# EAGLE design andre industrial microcontroler (EAGLE 9.6.2)
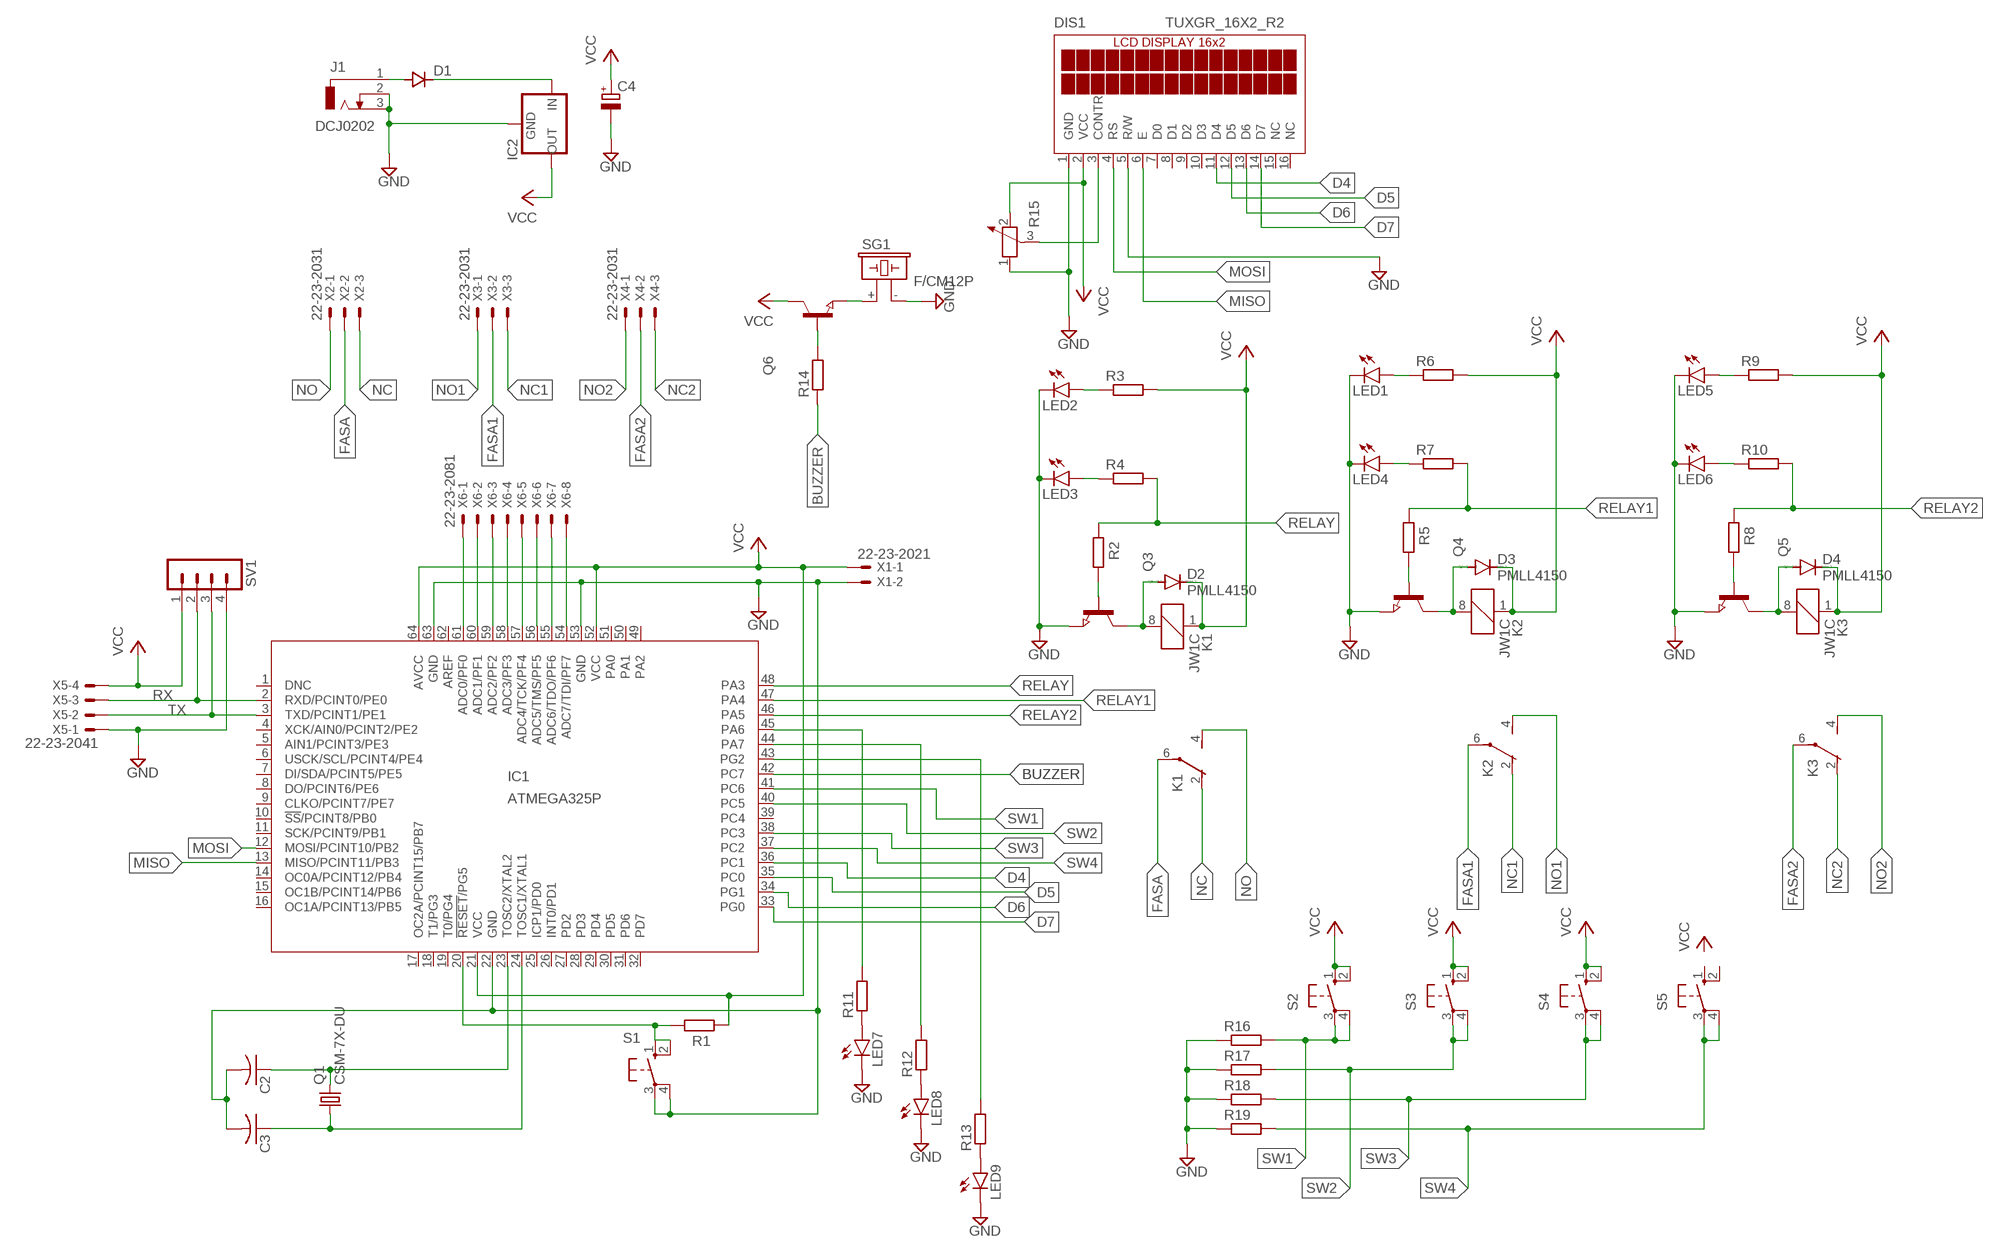
[diagram p0: schematic, sheet 1]

## Parts
C2  C-US025-024X044  [C025-024X044]
C3  C-US025-024X044  [C025-024X044]
C4  CPOL-EU140CLH-0810  [140CLH-0810]
D1  DSOD323  [SOD323]
D2  PMLL4150  [SOD80C]
D3  PMLL4150  [SOD80C]
D4  PMLL4150  [SOD80C]
DIS1  TUXGR_16X2_R2  [TUXGR_16X2_R2]
IC1  ATMEGA325P  [64M1]
IC2  78XXS  [78XXS]
J1  DCJ0202  [DCJ0202]
K1  JW1C  [JW1C]
K2  JW1C  [JW1C]
K3  JW1C  [JW1C]
LED1  LEDCHIP-LED0805  [CHIP-LED0805]
LED2  LEDCHIP-LED0805  [CHIP-LED0805]
LED3  LEDCHIP-LED0805  [CHIP-LED0805]
LED4  LEDCHIP-LED0805  [CHIP-LED0805]
LED5  LEDCHIP-LED0805  [CHIP-LED0805]
LED6  LEDCHIP-LED0805  [CHIP-LED0805]
LED7  LEDCHIP-LED0805  [CHIP-LED0805]
LED8  LEDCHIP-LED0805  [CHIP-LED0805]
LED9  LEDCHIP-LED0805  [CHIP-LED0805]
Q1  CSM-7X-DU  [CSM-7X-DU]
Q3  NPN-TRANSISTOR_SOT23  [SOT23]
Q4  NPN-TRANSISTOR_SOT23  [SOT23]
Q5  NPN-TRANSISTOR_SOT23  [SOT23]
Q6  NPN-TRANSISTOR_SOT23  [SOT23]
R1  R-EU_R0805  [R0805]
R2  R-EU_R0805  [R0805]
R3  R-EU_R0805  [R0805]
R4  R-EU_R0805  [R0805]
R5  R-EU_R0805  [R0805]
R6  R-EU_R0805  [R0805]
R7  R-EU_R0805  [R0805]
R8  R-EU_R0805  [R0805]
R9  R-EU_R0805  [R0805]
R10  R-EU_R0805  [R0805]
R11  R-EU_R0805  [R0805]
R12  R-EU_R0805  [R0805]
R13  R-EU_R0805  [R0805]
R14  R-EU_R0805  [R0805]
R15  POTENTIOMETER_PT-10  [PT-10]
R16  R-EU_R0805  [R0805]
R17  R-EU_R0805  [R0805]
R18  R-EU_R0805  [R0805]
R19  R-EU_R0805  [R0805]
S1  10-XX  [B3F-10XX]
S2  10-XX  [B3F-10XX]
S3  10-XX  [B3F-10XX]
S4  10-XX  [B3F-10XX]
S5  10-XX  [B3F-10XX]
SG1  F/CM12P  [F/CM12P]
SV1  MA04-1  [MA04-1]
X1  22-23-2021  [22-23-2021]
X2  22-23-2031  [22-23-2031]
X3  22-23-2031  [22-23-2031]
X4  22-23-2031  [22-23-2031]
X5  22-23-2041  [22-23-2041]
X6  22-23-2081  [22-23-2081]

## Nets
BUZZER: IC1.42(PC7) R14.1
D4: DIS1.11(D4) IC1.36(PC1)
D5: DIS1.12(D5) IC1.35(PC0)
D6: DIS1.13(D6) IC1.34(PG1)
D7: DIS1.14(D7) IC1.33(PG0)
FASA: K1.6(1:P) X2.2
FASA1: K2.6(1:P) X3.2
FASA2: K3.6(1:P) X4.2
GND: C2.2 C3.2 C4.- DIS1.1(GND) DIS1.5(R/W) IC1.22(GND) IC1.53(GND) IC1.63(GND) IC2.GND J1.2 J1.3 LED1.C LED2.C LED3.C LED4.C LED5.C LED6.C LED7.C LED8.C LED9.C Q3.2(E) Q4.2(E) Q5.2(E) R15.1 R16.1 R17.1 R18.1 R19.1 S1.3(P) S1.4(P1) SG1.- SV1.4 X1.2 X5.1
MISO: DIS1.6(E) IC1.13(MISO/PCINT11/PB3)
MOSI: DIS1.4(RS) IC1.12(MOSI/PCINT10/PB2)
N$1: IC1.20(!RESET!/PG5) R1.1 S1.1(S) S1.2(S1)
N$2: D1.1(C) IC2.IN
N$3: D1.2(A) J1.1
N$4: C2.1 IC1.23(TOSC2/XTAL2) Q1.2
N$5: C3.1 IC1.24(TOSC1/XTAL1) Q1.1
N$6: D3.A K2.8 Q4.3(C)
N$7: D2.A K1.8 Q3.3(C)
N$8: Q4.1(B) R5.1
N$9: Q3.1(B) R2.1
N$10: LED3.A R4.1
N$11: LED2.A R3.1
N$12: LED4.A R7.1
N$13: LED1.A R6.1
N$14: D4.A K3.8 Q5.3(C)
N$15: Q5.1(B) R8.1
N$16: LED6.A R10.1
N$17: LED5.A R9.1
N$20: LED9.A R13.1
N$21: IC1.43(PG2) R13.2
N$22: IC1.45(PA6) R11.2
N$23: LED7.A R11.1
N$24: IC1.44(PA7) R12.2
N$25: LED8.A R12.1
N$26: IC1.61(ADC0/PF0) X6.1
N$27: IC1.60(ADC1/PF1) X6.2
N$28: IC1.59(ADC2/PF2) X6.3
N$29: IC1.58(ADC3/PF3) X6.4
N$30: IC1.57(ADC4/TCK/PF4) X6.5
N$31: IC1.56(ADC5/TMS/PF5) X6.6
N$32: IC1.55(ADC6/TDO/PF6) X6.7
N$33: IC1.54(ADC7/TDI/PF7) X6.8
N$34: Q6.2(E) SG1.+
N$35: Q6.1(B) R14.2
N$36: DIS1.3(CONTR) R15.3
NC: K1.2(1:O) X2.3
NC1: K2.2(1:O) X3.3
NC2: K3.2(1:O) X4.3
NO: K1.4(1:S) X2.1
NO1: K2.4(1:S) X3.1
NO2: K3.4(1:S) X4.1
RELAY: IC1.48(PA3) R2.2 R4.2
RELAY1: IC1.47(PA4) R5.2 R7.2
RELAY2: IC1.46(PA5) R8.2 R10.2
RX: IC1.2(RXD/PCINT0/PE0) SV1.2 X5.3
SW1: IC1.41(PC6) R16.2 S2.3(P) S2.4(P1)
SW2: IC1.40(PC5) R17.2 S3.3(P) S3.4(P1)
SW3: IC1.38(PC3) R18.2 S4.3(P) S4.4(P1)
SW4: IC1.37(PC2) R19.2 S5.3(P) S5.4(P1)
TX: IC1.3(TXD/PCINT1/PE1) SV1.3 X5.2
VCC: C4.+ D2.C D3.C D4.C DIS1.2(VCC) IC1.21(VCC) IC1.52(VCC) IC1.64(AVCC) IC2.OUT K1.1 K2.1 K3.1 Q6.3(C) R1.2 R3.2 R6.2 R9.2 R15.2 S2.1(S) S2.2(S1) S3.1(S) S3.2(S1) S4.1(S) S4.2(S1) SV1.1 X1.1 X5.4
Unconnected: DIS1.7(D0) DIS1.8(D1) DIS1.9(D2) DIS1.10(D3) DIS1.15(NC) DIS1.16(NC) IC1.1(DNC) IC1.4(XCK/AIN0/PCINT2/PE2) IC1.5(AIN1/PCINT3/PE3) IC1.6(USCK/SCL/PCINT4/PE4) IC1.7(DI/SDA/PCINT5/PE5) IC1.8(DO/PCINT6/PE6) IC1.9(CLKO/PCINT7/PE7) IC1.10(!SS!/PCINT8/PB0) IC1.11(SCK/PCINT9/PB1) IC1.14(OC0A/PCINT12/PB4) IC1.15(OC1B/PCINT14/PB6) IC1.16(OC1A/PCINT13/PB5) IC1.17(OC2A/PCINT15/PB7) IC1.18(T1/PG3) IC1.19(T0/PG4) IC1.25(ICP1/PD0) IC1.26(INT0/PD1) IC1.27(PD2) IC1.28(PD3) IC1.29(PD4) IC1.30(PD5) IC1.31(PD6) IC1.32(PD7) IC1.39(PC4) IC1.49(PA2) IC1.50(PA1) IC1.51(PA0) IC1.62(AREF) S5.1(S) S5.2(S1)

## Library data of the parts
C2 C3 = rcl:C-US: CAPACITOR, American symbol; SPICEPREFIX: C
C4 = rcl:CPOL-EU: POLARIZED CAPACITOR, European symbol; SPICEPREFIX: C
D1 = zetex:D: DIODE; MPN: CDSOD323-T05C; OC_FARNELL: 1824860; OC_NEWARK: 79R6078
D2-D4 = diode:PMLL4150: DIODE high speed
DIS1 = display-lcd:TUXGR_16X2_R2: Tuxgraphics LCD display 16x2 characters reflective, without background light Source: tuxgr_12x2_r2.pdf; OC_FARNELL: unknown; OC_NEWARK: unknown
IC1 = atmel:ATMEGA325P: 8-bit Microcontroller with 32K Bytes In-System Programmable Flash Source: http://www.atmel.com .. doc8023.pdf; MPN: ATMEGA325PV-10AU; OC_FARNELL: 1636939; OC_NEWARK: 03P2025
IC2 = v-reg:78XXS: VOLTAGE REGULATOR
J1 = con-jack:DCJ0202: DC POWER JACK Source: DCJ0202.pdf; OC_FARNELL: unknown; OC_NEWARK: unknown
K1-K3 = relay:JW1C: Power relay Source: Panasonic Electric Works Co., Ltd. / jw.catalog.pdf
LED1-LED9 = led:LED: LED OSRAM: - CHIPLED LG R971, LG N971, LY N971, LG Q971, LY Q971, LO R971, LY R971 LH N974, LH R974 LS Q976, LO Q976, LY Q976 LO Q996 - Hyper CHIPLED LW Q18S LB Q993, LB Q99A, LB R99A - SideLED LS A670, LO A670, LY A670, LG A670, LP A670 LB A673, LV A673, LT A673, LW A673 LH A674 LY A675 LS A676, LA A676, LO A676, LY A676, LW A676 LS A679, LY A679, LG A679 - Hyper Micro SIDELED® LS Y876, LA Y876, LO Y876, LY Y876 LT Y87S - SmartLED LW L88C, LW L88S LB L89C, LB L89S, LG L890 LS L89K, LO L89K, LY L89K LS L896, LA L896, LO L896, LY L896 - TOPLED LS T670, LO T670, LY T670, LG T670, LP T670 LSG T670, LSP T670, LSY T670, LOP T670, LYG T670 LG T671, LOG T671, LSG T671 LB T673, LV T673, LT T673, LW T673 LH T674 LS T676, LA T676, LO T676, LY T676, LB T676, LH T676, LSB T676, LW T676 LB T67C, LV T67C, LT T67C, LS T67K, LO T67K, LY T67K, LW E67C LS E67B, LA E67B, LO E67B, LY E67B, LB E67C, LV E67C, LT E67C LW T67C LS T679, LY T679, LG T679 LS T770, LO T770, LY T770, LG T770, LP T770 LB T773, LV T773, LT T773, LW T773 LH T774 LS E675, LA E675, LY E675, LS T675 LS T776, LA T776, LO T776, LY T776, LB T776 LHGB T686 LT T68C, LB T68C - Hyper Mini TOPLED® LB M676 - Mini TOPLED Santana® LG M470 LS M47K, LO M47K, LY M47K Source: http://www.osram.convergy.de LUXEON: - LUMILED® LXK2-PW12-R00, LXK2-PW12-S00, LXK2-PW14-U00, LXK2-PW14-V00 LXK2-PM12-R00, LXK2-PM12-S00, LXK2-PM14-U00 LXK2-PE12-Q00, LXK2-PE12-R00, LXK2-PE12-S00, LXK2-PE14-T00, LXK2-PE14-U00 LXK2-PB12-K00, LXK2-PB12-L00, LXK2-PB12-M00, LXK2-PB14-N00, LXK2-PB14-P00, LXK2-PB14-Q00 LXK2-PR12-L00, LXK2-PR12-M00, LXK2-PR14-Q00, LXK2-PR14-R00 LXK2-PD12-Q00, LXK2-PD12-R00, LXK2-PD12-S00 LXK2-PH12-R00, LXK2-PH12-S00 LXK2-PL12-P00, LXK2-PL12-Q00, LXK2-PL12-R00 Source: www.luxeon.com KINGBRIGHT: KA-3528ASYC Source: www.kingbright.com
Q1 = crystal:CSM-7X-DU: SMD CRYSTAL Source: www.ecsxtal.com .. Crystal 3.6864MHz CSM_7X_DU.PDF; OC_FARNELL: unknown; OC_NEWARK: unknown
Q3-Q6 = semicon-smd-ipc:NPN-TRANSISTOR_: NPN TRANSISTOR
R1-R14 R16-R19 = rcl:R-EU_: RESISTOR, European symbol; SPICEPREFIX: R
R15 = rcl:POTENTIOMETER_: Potentiometer; SPICEMODEL: POT; SPICEPREFIX: X
S1-S5 = switch-omron:10-XX: OMRON SWITCH; MPN: B3F-1000; OC_FARNELL: 176432; OC_NEWARK: 36M3542
SG1 = buzzer:F/CM12P: BUZZER Source: Buerklin; OC_FARNELL: unknown; OC_NEWARK: unknown
SV1 = con-lstb:MA04-1: PIN HEADER; OC_FARNELL: unknown; OC_NEWARK: unknown
X1 = con-molex:22-23-2021: .100" (2.54mm) Center Header - 2 Pin; MF: MOLEX; MPN: 22-23-2021; OC_FARNELL: 1462926; OC_NEWARK: 25C3832
X2-X4 = con-molex:22-23-2031: .100" (2.54mm) Center Header - 3 Pin; MF: MOLEX; MPN: 22-23-2031; OC_FARNELL: 1462950; OC_NEWARK: 30C0862
X5 = con-molex:22-23-2041: .100" (2.54mm) Center Header - 4 Pin; MF: MOLEX; MPN: 22-23-2041; OC_FARNELL: 1462920; OC_NEWARK: 38C0355
X6 = con-molex:22-23-2081: .100" (2.54mm) Center Header - 8 Pin; MF: MOLEX; MPN: 22-23-2081; OC_FARNELL: 1756826; OC_NEWARK: 01C7592

## Board
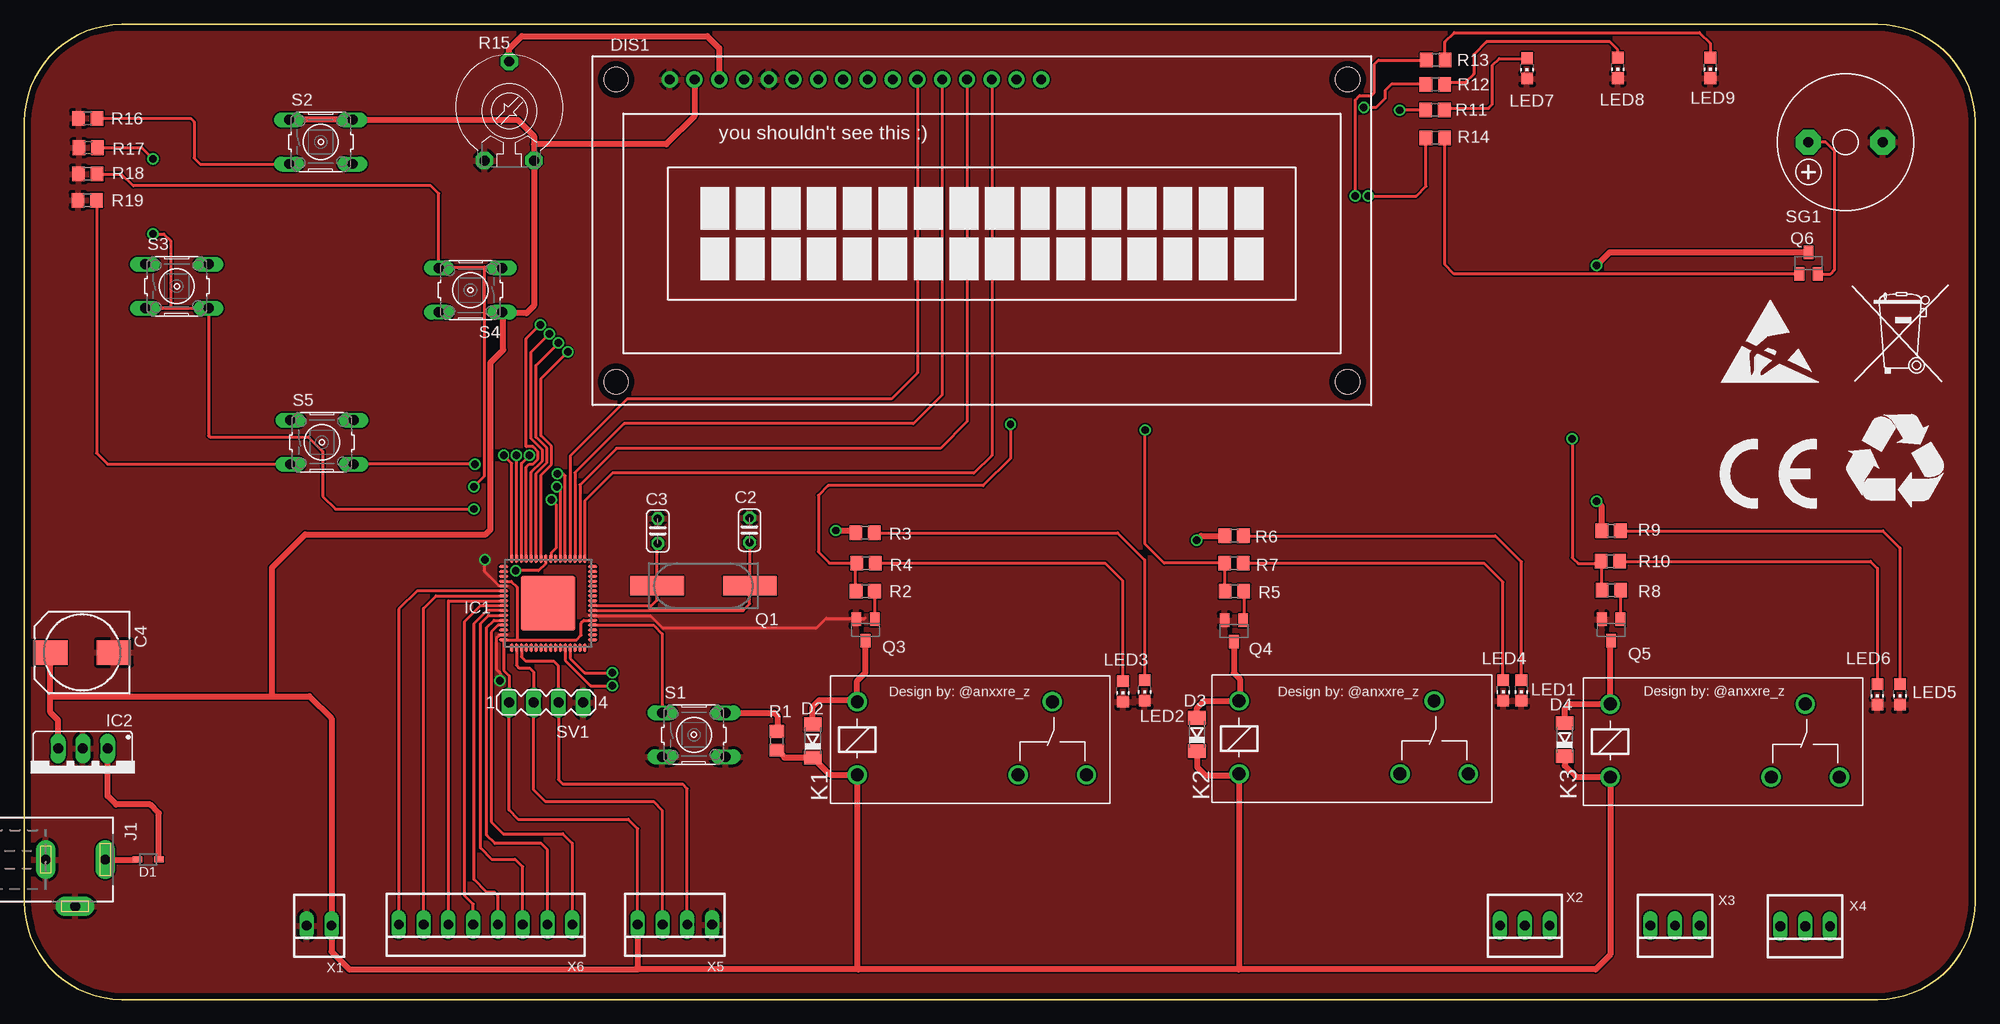
[diagram p1: board, top side]
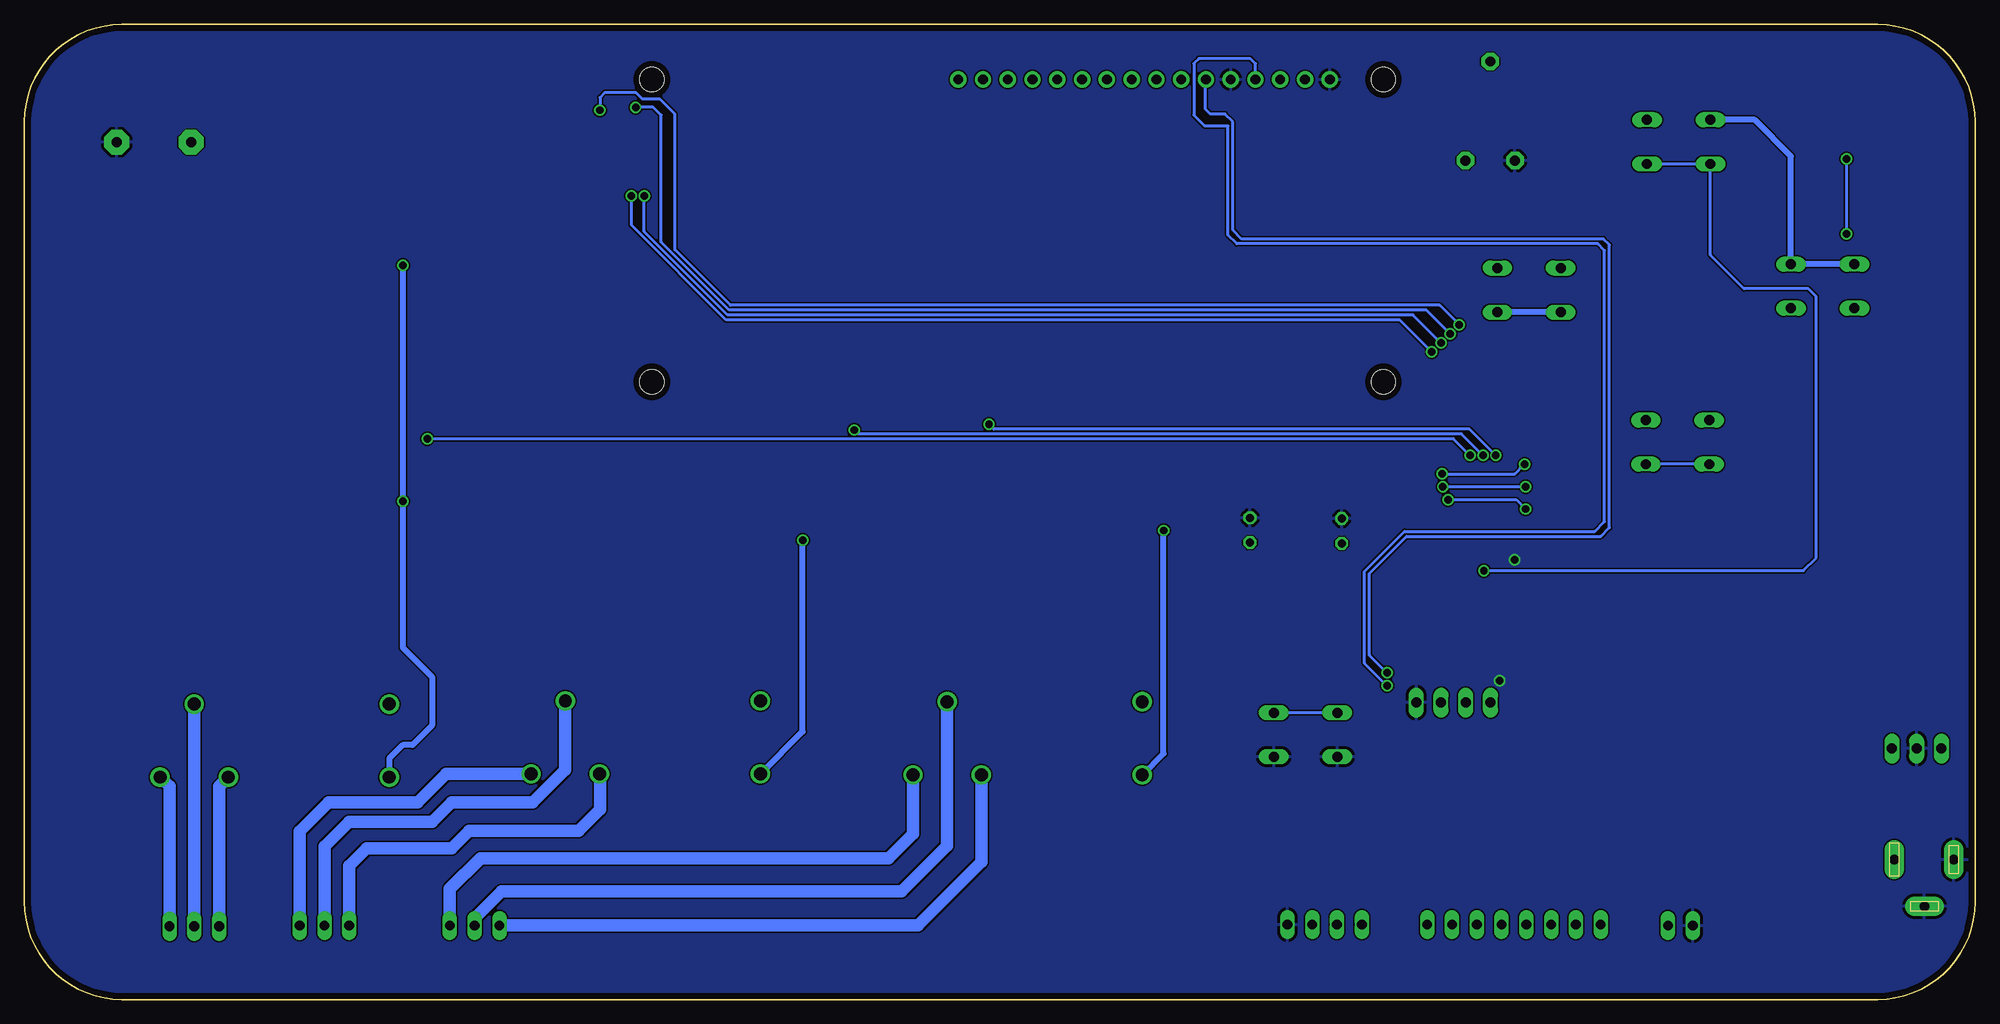
[diagram p2: board, bottom side, seen from below]

Size 200 x 100 mm. Coordinates in mm from the lower left corner, seen from the top.
Outline: 0,10 0,90 arc-90 10,100 190,100 arc-90 200,90 200,10 arc-90 190,0 10,0 arc-90 0,10
Copper layers (1*16): Top 0.035mm / dielectric 1.5mm / Bottom 0.035mm
Design rules "default *": minimum track width 12mil, minimum drill 30mil, track to track 6mil, track to pad 6mil, pad to pad 6mil, via to via 6mil, smd to smd 6mil, copper to edge 24mil, drill to drill 6mil, minimum pad ring 10mil, minimum via ring 8mil, stop-mask expansion 4mil, vias tented up to drill 0mil, thermal gap 12mil

### Footprints (pad centres in the part's own frame; a part is rotated, then mirrored left to right if it is on the bottom)
C025-024X044 = drill 0.813 octagon: 1 -1.27,0; 2 1.27,0
140CLH-0810 = smd 3.5 x 2.5: + 3.25,0; - -3.25,0
SOD323 = smd 1 x 0.6: 1 -1.1,0; 2 1.1,0
SOD80C = smd 1.4 x 1.8: A 1.7,0; C -1.7,0
TUXGR_16X2_R2 = drill 1 pad 1.676: 1 -32,15.5; 2 -29.46,15.5; 3 -26.92,15.5; 4 -24.38,15.5; 5 -21.84,15.5; 6 -19.3,15.5; 7 -16.76,15.5; 8 -14.22,15.5; 9 -11.68,15.5; 10 -9.14,15.5; 11 -6.6,15.5; 12 -4.06,15.5; 13 -1.52,15.5; 14 1.02,15.5; 15 3.56,15.5; 16 6.1,15.5 | hole 2.5: -37.5,-15.5; 37.5,-15.5; -37.5,15.5; 37.5,15.5
64M1 = smd 0.95 x 0.3: 1 -4.56,3.75; 2 -4.56,3.25; 3 -4.56,2.75; 4 -4.56,2.25; 5 -4.56,1.75; 6 -4.56,1.25; 7 -4.56,0.75; 8 -4.56,0.25; 9 -4.56,-0.25; 10 -4.56,-0.75; 11 -4.56,-1.25; 12 -4.56,-1.75; 13 -4.56,-2.25; 14 -4.56,-2.75; 15 -4.56,-3.25; 16 -4.56,-3.75; 33 4.56,-3.75; 34 4.56,-3.25; 35 4.56,-2.75; 36 4.56,-2.25; 37 4.56,-1.75; 38 4.56,-1.25; 39 4.56,-0.75; 40 4.56,-0.25; 41 4.56,0.25; 42 4.56,0.75; 43 4.56,1.25; 44 4.56,1.75; 45 4.56,2.25; 46 4.56,2.75; 47 4.56,3.25; 48 4.56,3.75 | smd 0.3 x 0.95: 17 -3.75,-4.56; 18 -3.25,-4.56; 19 -2.75,-4.56; 20 -2.25,-4.56; 21 -1.75,-4.56; 22 -1.25,-4.56; 23 -0.75,-4.56; 24 -0.25,-4.56; 25 0.25,-4.56; 26 0.75,-4.56; 27 1.25,-4.56; 28 1.75,-4.56; 29 2.25,-4.56; 30 2.75,-4.56; 31 3.25,-4.56; 32 3.75,-4.56; 49 3.75,4.56; 50 3.25,4.56; 51 2.75,4.56; 52 2.25,4.56; 53 1.75,4.56; 54 1.25,4.56; 55 0.75,4.56; 56 0.25,4.56; 57 -0.25,4.56; 58 -0.75,4.56; 59 -1.25,4.56; 60 -1.75,4.56; 61 -2.25,4.56; 62 -2.75,4.56; 63 -3.25,4.56; 64 -3.75,4.56 | smd 5.6 x 5.6: EXP 0,0
78XXS = drill 1.016 long: GND 0,-2.54; IN -2.54,-2.54; OUT 2.54,-2.54
DCJ0202 = drill 1 pad 2 long: 1 0,3.1; 2 4.8,0; 3 0,-3
JW1C = drill 1.321 pad 1.9: 1 -10,-3.683; 2 6.5,-3.683; 4 13.5,-3.683; 6 10,3.81; 8 -10,3.81
CHIP-LED0805 = smd 1.2 x 1.2: A 0,-1.05; C 0,1.05
CSM-7X-DU = smd 5.5 x 2: 1 -4.75,0; 2 4.75,0
SOT23 = smd 1 x 1.4: 1 -0.95,-1.1; 2 0.95,-1.1; 3 0,1.1
R0805 = smd 1.3 x 1.5: 1 -0.95,0; 2 0.95,0
PT-10 = drill 1.016 pad 1.778 octagon: 1 -2.54,-5.08; 2 2.54,-5.08; 3 0,5.08
B3F-10XX = drill 1.016 long: 1 -3.251,2.261; 2 3.251,2.261; 3 -3.251,-2.261; 4 3.251,-2.261
F/CM12P = drill 1.016 pad 2.54 octagon: + 3.81,0; - -3.81,0
MA04-1 = drill 1.016 long: 1 -3.81,0; 2 -1.27,0; 3 1.27,0; 4 3.81,0
22-23-2021 = drill 1 long: 1 -1.27,0; 2 1.27,0
22-23-2031 = drill 1 long: 1 -2.54,0; 2 0,0; 3 2.54,0
22-23-2041 = drill 1 long: 1 -3.81,0; 2 -1.27,0; 3 1.27,0; 4 3.81,0
22-23-2081 = drill 1 long: 1 -8.89,0; 2 -6.35,0; 3 -3.81,0; 4 -1.27,0; 5 1.27,0; 6 3.81,0; 7 6.35,0; 8 8.89,0

### Placement (x,y rotation side)
C2  74.34,48.13 90 top
C3  64.94,48.05 90 top
C4  5.92,35.58 180 top
D1  12.69,14.36 180 top
D2  80.82,26.51 90 top
D3  120.22,27.18 90 top
D4  157.92,26.65 90 top
DIS1  98.16,78.85 0 top
IC1  53.71,40.64 90 top
IC2  6,23.2 180 top
J1  5.2,14.35 270 top
K1  95.39,26.72 0 top
K2  134.54,26.82 0 top
K3  172.59,26.49 0 top
LED1  153.48,31.69 180 top
LED2  114.86,31.69 180 top
LED3  112.64,31.59 180 top
LED4  151.62,31.69 180 top
LED5  192.3,31.29 180 top
LED6  189.98,31.29 180 top
LED7  154.06,95.49 180 top
LED8  163.37,95.54 180 top
LED9  172.85,95.54 180 top
Q1  69.62,42.42 0 top
Q3  86.23,37.89 180 top
Q4  124.01,37.79 180 top
Q5  162.69,37.89 180 top
Q6  182.93,75.51 0 top
R1  77.14,26.54 270 top
R2  86.22,41.86 180 top
R3  86.2,47.86 180 top
R4  86.28,44.76 180 top
R5  124.06,41.86 180 top
R6  124.04,47.56 180 top
R7  124.02,44.76 180 top
R8  162.7,41.96 180 top
R9  162.68,48.06 180 top
R10  162.6,44.94 180 top
R11  144.63,91.24 180 top
R12  144.65,93.84 180 top
R13  144.7,96.34 180 top
R14  144.65,88.36 0 top
R15  49.71,91.12 0 top
R16  6.5,90.36 0 top
R17  6.55,87.36 0 top
R18  6.5,84.66 0 top
R19  6.45,81.96 0 top
S1  68.65,27.15 0 top
S2  30.39,87.95 0 top
S3  15.63,73.15 0 top
S4  45.73,72.75 180 top
S5  30.51,57.15 0 top
SG1  186.72,87.91 180 top
SV1  53.49,30.46 0 top
U$1  [MUELLTONNE_10.00]  186.76,62.94 0 top
U$2  [ESD_10.00]  173.9,63.17 0 top
U$3  [RECYCLING_10.00]  186.68,50.3 0 top
U$4  [CE_7.3MM]  173.78,50.28 0 top
X1  30.22,7.58 180 top
X2  153.84,7.58 180 top
X3  169.23,7.58 180 top
X4  182.58,7.51 180 top
X5  66.69,7.68 180 top
X6  47.28,7.68 180 top

### Tracks (layer width: path | path; a pad name or v marks a point on that pad's centre or on a via)
BUZZER  (via drill 0.76)
  Top 0.305: v55.7,66.4 52.96,63.66 52.96,57.82 54.04,56.74 54.04,54.86 52.96,53.78 IC1.42 | v137.76,82.4 142.7,82.4 143.7,83.4 R14.1
  Bottom 0.305: v55.7,66.4 59,69.7 128.04,69.7 137.76,79.42 v137.76,82.4
D4
  Top 0.33: DIS1.11 91.56,64.26 88.9,61.6 61.8,61.6 55.96,55.76 IC1.36
D5
  Top 0.33: DIS1.12 94.1,62.01 91.15,59.06 61.5,59.06 56.46,54.02 IC1.35
D6
  Top 0.33: DIS1.13 96.64,59.26 93.9,56.52 60.7,56.52 56.96,52.78 IC1.34
D7
  Top 0.33: DIS1.14 99.18,55.8 97.36,53.98 60.3,53.98 57.46,51.14 IC1.33
FASA
  Bottom 1.27: K1.6 105.39,17.91 105.4,17.9 105.4,15.77 110.09,11.08 151.09,11.08 153.84,8.33 X2.2
FASA1
  Bottom 1.27: X3.2 169.2,7.61 169.2,9.4 169.2,15.7 166.7,18.2 158.2,18.2 156.2,20.2 147.9,20.2 144.54,23.56 K2.6
FASA2
  Bottom 1.27: K3.6 X4.2
GND  (via drill 0.76)
  Top 0.305: IC1.63 49.12,37.36 48.65,37.36 48.37,37.08 48.37,33.87 48.76,33.48 v48.76,32.7 | IC1.22 58.3,39.36 64.19,39.36 65.45,38.1 81.2,38.1 82.2,39.1 86.2,39.1 86.09,38.99 Q3.2 | IC1.53 49.12,42.42 48.65,42.42 47.2,43.87 v47.2,45.1
  pour Bottom: 0.2,91.1 arc-90 9.2,100.1 190.2,100.1 arc-90 200.2,90.1 200.2,10.1 arc-90 190.2,0.1 9.2,0.1 arc-90 0.2,9.1
  pour Top: 0.2,88.1 0.2,91.1 arc-90 9.2,100.1 190.2,100.1 arc-90 200.2,90.1 200.2,10.1 arc-90 190.2,0.1 9.2,0.1 arc-90 0.2,9.1
MISO  (via drill 0.76)
  Top 0.305: IC1.13 55.96,34.99 57.46,33.5 v60.3,33.5
  Bottom 0.305: v60.3,33.5 62.1,35.3 62.1,43.7 58.3,47.5 38.39,47.5 37.5,48.39 37.5,77.41 38.09,78 75.2,78 76.1,78.9 76.1,90 76.9,90.8 78.4,90.8 78.9,91.3 78.9,93.7 78.8,93.8 78.8,94.29 DIS1.6
MOSI  (via drill 0.76)
  Top 0.305: IC1.12 55.46,34.79 58.07,32.18 v60.3,32.18
  Bottom 0.305: v60.3,32.18 62.6,34.48 62.6,43.91 58.51,48 39,48 38,49 38,76.8 38.7,77.5 75.71,77.5 76.6,78.39 76.6,89.6 79,89.6 80.1,90.7 80.1,96 79.6,96.5 74.3,96.5 73.78,95.98 DIS1.4
N$1
  Top 0.305: IC1.20 64.51,38.39 65.4,37.5 S1.1
  Top 0.61: S1.2 76.89,29.41 77.2,29.1 77.2,27.55 R1.1
  Bottom 0.305: S1.1 S1.2
N$2
  Top 0.61: D1.1 13.79,19.11 12.9,20 9.4,20 8.54,20.86 IC2.IN
N$3
  Top 0.61: J1.1 D1.2
N$4
  Top 0.305: IC1.23 73.69,39.89 74.37,40.57 74.37,42.1 Q1.2 74.37,46.83 C2.1
N$5
  Top 0.305: IC1.24 64.29,40.39 64.87,40.97 Q1.1 64.87,46.71 C3.1
N$6
  Top 0.61: D3.A 120.22,29.92 120.93,30.63 K2.8 124.6,30.69 124.6,32.9 124.01,33.49 Q4.3
N$7
  Top 0.61: D2.A 80.82,30.02 81.5,30.7 85.22,30.7 K1.8 85.39,32.69 86.23,33.53 Q3.3
N$8
  Top 0.305: R5.1 125.01,38.94 Q4.1
N$9
  Top 0.305: R2.1 Q3.1
N$10
  Top 0.305: LED3.A 112.6,32.68 112.6,42.96 110.8,44.76 R4.1
N$11
  Top 0.305: R3.1 112.08,47.86 114.86,45.08 LED2.A
N$12
  Top 0.305: LED4.A 151.6,32.76 151.6,42.8 149.64,44.76 R7.1
N$13
  Top 0.305: LED1.A | LED1.A 153.48,44.88 150.8,47.56 R6.1
N$14
  Top 0.61: D4.A 157.92,29.82 158.4,30.3 K3.8 162.59,36.69 Q5.3
N$15
  Top 0.305: R8.1 Q5.1
N$16
  Top 0.305: LED6.A 189.98,44.22 189.26,44.94 R10.1
N$17
  Top 0.305: LED5.A 192.3,46.31 190.55,48.06 R9.1
N$20
  Top 0.305: R13.1 145.65,98.21 146.6,99.16 171.74,99.16 172.85,98.05 LED9.A
N$21  (via drill 0.76)
  Top 0.305: v54.77,67.33 52.46,65.03 52.46,57.67 53.58,56.55 53.58,55.05 52.46,53.93 IC1.43 | R13.2 138.84,96.34 138.4,95.9 138.4,93 138.1,92.7 136.9,92.7 136.44,92.24 v136.44,82.4
  Bottom 0.305: v54.77,67.33 57.63,70.2 127.89,70.2 136.44,78.75 v136.44,82.4
N$22  (via drill 0.76)
  Top 0.305: v52.9,69.2 51.46,67.76 51.46,56.69 52.15,56.69 52.67,56.17 52.67,55.43 52.15,54.91 51.77,54.91 51.46,54.6 IC1.45 | v141,91.2 141.04,91.24 R11.2
  Bottom 0.305: v52.9,69.2 54.9,71.2 127.6,71.2 133.3,76.9 133.3,90.8 134.84,92.34 136.64,92.34 137.3,93 140.5,93 141,92.5 v141,91.2
N$23
  Top 0.305: R11.1 145.74,91.4 150.1,91.4 150.5,91.8 150.5,95.8 151.2,96.5 154.02,96.5 LED7.A
N$24  (via drill 0.76)
  Top 0.305: v53.83,68.27 51.96,66.4 51.96,57.52 53.13,56.36 53.13,55.24 51.96,54.08 IC1.44 | R12.2 140.14,93.84 139.5,93.2 139.5,92.4 138.6,91.5 v137.33,91.5
  Bottom 0.305: v53.83,68.27 56.26,70.7 127.75,70.7 134.72,77.67 134.72,90.69 135.53,91.5 v137.33,91.5
N$25
  Top 0.305: LED8.A 163.37,97.39 162.56,98.2 149.9,98.2 148.6,96.9 148.6,94.9 147.7,94 145.76,94 R12.1
N$26
  Top 0.305: IC1.61 48.58,38.39 47.87,37.68 47.87,18.22 49.09,17 55.2,17 56.17,16.03 X6.1
N$27
  Top 0.305: IC1.60 48.14,38.89 47.41,38.17 47.41,16.84 48.25,16 53,16 53.63,15.37 53.63,8.43 X6.2
N$28
  Top 0.305: IC1.59 47.59,39.39 46.76,38.56 46.76,15.54 47.9,14.4 50.3,14.4 51.09,13.61 51.09,8.43 X6.3
N$29
  Top 0.305: IC1.58 47.44,39.89 46.1,38.55 46.1,12.3 47.4,11 48.2,11 48.55,10.65 48.55,8.43 X6.4
N$30
  Top 0.305: IC1.57 46.8,40.39 45.11,38.7 45.11,10.68 46.01,9.78 46.01,8.43 X6.5
N$31
  Top 0.305: X6.6 43.47,40.89 IC1.56
N$32
  Top 0.305: X6.7 40.93,40.12 42.2,41.39 IC1.55
N$33
  Top 0.305: IC1.54 40.24,41.89 38.39,40.04 X6.8
N$34
  Top 0.305: Q6.2 185.18,74.41 185.58,74.81 185.58,87.04 184.71,87.91 SG1.+
N$35
  Top 0.305: R14.2 145.6,75.39 146.58,74.41 Q6.1
N$36
  Top 0.61: R15.3 49.71,97.51 51,98.8 70,98.8 71.24,97.56 DIS1.3
NC
  Bottom 1.27: K1.2 101.89,14.11 108.37,7.63 151.3,7.63 X2.3
NC1
  Bottom 1.27: K2.2 141,23.1 141,19.5 143.2,17.3 154.4,17.3 156.2,15.5 164.9,15.5 166.69,13.71 X3.3
NC2
  Bottom 1.27: K3.2 180.04,21.86 X4.3
NO
  Bottom 1.27: K1.4 108.89,17.01 111.4,14.5 153.21,14.5 156.38,11.33 X2.1
NO1
  Bottom 1.27: K2.4 156.76,23.14 159.7,20.2 168.8,20.2 171.77,17.23 X3.1
NO2
  Bottom 1.27: K3.4 185.12,21.84 X4.1
RELAY  (via drill 0.76)
  Top 0.33: IC1.48 49.96,54.98 v49.14,55.8 | v101.1,59 101.1,55.5 98.3,52.7 82.4,52.7 81.4,51.7 81.4,45.9 82.54,44.76 85.2,44.76 | 85.2,44.76 R4.2 | R2.2 85.2,41.93 85.2,44.76
  Bottom 0.33: v49.14,55.8 51.84,58.5 100.6,58.5 v101.1,59
RELAY1  (via drill 0.76)
  Top 0.33: IC1.47 v50.46,55.8 | v114.9,58.4 114.9,46.7 116.84,44.76 R7.2 123.11,44.72 123.11,44.11 123.11,42.1 R5.2
  Bottom 0.33: v50.46,55.8 52.66,58 114.5,58 v114.9,58.4
RELAY2  (via drill 0.76)
  Top 0.33: IC1.46 50.96,54.98 v51.78,55.8 | v158.7,57.5 158.7,45.3 159.3,44.7 161.41,44.7 R10.2 161.75,44.84 R8.2
  Bottom 0.33: v51.78,55.8 53.48,57.5 v158.7,57.5
RX
  Top 0.305: IC1.2 50.46,34.29 50.75,34 51.8,34 52.22,33.58 SV1.2 52.22,21.49 53.41,20.3 64.5,20.3 65.42,19.37 X5.3
SW1  (via drill 0.76)
  Top 0.305: IC1.41 53.42,45.16 53.42,44.69 52.72,43.99 v50.36,43.99 | S2.3 18.01,85.69 17.4,86.3 17.4,90 17.04,90.36 R16.2
  Bottom 0.305: v50.36,43.99 17.61,43.99 16.3,45.3 16.3,72.1 17.1,72.9 23.7,72.9 27.14,76.34 S2.3 S2.4
SW2  (via drill 0.76)
  Top 0.305: IC1.40 54.01,45.25 54.01,45.8 54.5,46.3 54.5,50.79 v54.03,51.26 | R17.2 12.04,87.36 v13.2,86.2 | v13.2,78.5 14.3,78.5 15,77.8 15,70.9 S3.3 S3.4 18.88,57.82 19,57.7 29.12,57.7 30.6,56.22 30.6,51.6 31.9,50.3 v46.1,50.3
  Bottom 0.305: v54.03,51.26 47.06,51.26 v46.1,50.3 | v13.2,86.2 v13.2,78.5
SW3  (via drill 0.76)
  Top 0.305: IC1.38 54.96,52.19 v54.57,52.58 | 47.15,75.11 47.15,53.65 v46.1,52.6 | R18.2 9.95,84.66 11.16,83.45 41.68,83.45 42.48,82.65 S4.4 42.58,75.11 47.15,75.11 | 47.15,75.11 48.88,75.11 S4.3
  Bottom 0.305: v54.57,52.58 54.55,52.6 v46.1,52.6
SW4  (via drill 0.76)
  Top 0.305: IC1.37 55.46,53.7 55.26,53.9 v54.66,53.9 | v46.2,54.9 34.53,54.9 34.52,54.89 S5.4 | R19.2 7.4,56.03 8.54,54.89 S5.3
  Bottom 0.305: v54.66,53.9 47.2,53.9 v46.2,54.9 | S5.3 S5.4
TX
  Top 0.305: IC1.3 50.96,35.14 51.4,34.7 54.28,34.7 54.76,34.22 SV1.3 54.76,22.54 55.2,22.1 67.48,22.1 67.96,21.62 X5.2
VCC  (via drill 0.76)
  Top 0.305: SV1.1 49.68,19.44 50.62,18.5 61.9,18.5 62.88,17.52 X5.4
  Top 0.33: SV1.1 49.7,30.48 49.7,33.2 49.15,33.75 IC1.64 50.5,36.89 | 50.5,36.89 56.62,36.89 57.1,37.37 57.1,38.61 57.38,38.89 IC1.21 | IC1.52 49.91,42.89 50.5,42.3 50.5,36.89
  Top 0.61: IC2.OUT 3.46,28.64 2.67,29.43 2.67,31.1 | 2.67,31.1 C4.+ | 2.67,31.1 25.4,31.1 | 25.4,31.1 29.2,31.1 31.49,28.81 X1.1 31.49,4.91 33.3,3.1 62.9,3.1 | 62.9,3.1 62.9,7.66 X5.4 | 124.5,3.1 161.1,3.1 162.59,4.59 K3.1 159.09,22.81 157.92,23.98 D4.C | 124.5,3.1 85.5,3.1 | 85.5,3.1 62.9,3.1 | 124.5,3.1 124.54,3.14 K2.1 124.4,23 121.1,23 120.22,23.88 D3.C | 85.5,3.1 85.39,3.21 K1.1 82.59,23.04 D2.C 77.92,24.81 R1.2 | 25.4,31.1 25.4,44.3 28.8,47.7 47.3,47.7 47.8,48.2 47.8,65.3 49.1,66.6 49.1,70.37 | 49.1,70.37 S4.1 | 49.1,70.37 51.47,70.37 52.25,71.15 R15.2 52.25,87.7 | S2.1 S2.2 50.59,90.21 52.25,88.55 52.25,87.7 | DIS1.2 68.7,90.6 65.8,87.7 52.25,87.7 | R9.2 161.73,50.57 v161.2,51.1 | v120.2,47.1 120.66,47.56 R6.2 | v83.2,48.1 85.01,48.1 R3.2 | Q6.3 162.51,76.61 v161.2,75.3
  Bottom 0.61: S3.1 S3.2 18.88,86.48 22.61,90.21 S2.1 | K3.1 162.59,24.71 161.2,26.1 160.2,26.1 158.2,28.1 158.2,33.1 161.2,36.1 v161.2,51.1 v161.2,75.3 | K2.1 120.2,27.48 v120.2,47.1 | K1.1 83.2,25.23 v83.2,48.1 | S4.2 S4.1

### Text on the board
tNames: you shouldn't see this :) | Design by: @anxxre_z | Design by: @anxxre_z | Design by: @anxxre_z